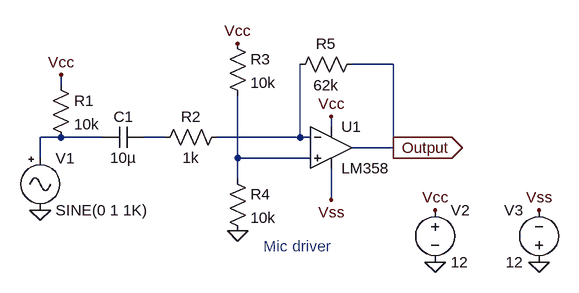
[diagram p0: schematic MicDriver.asc]
MicDriver.asc, the LTspice schematic file:
Version 4
SHEET 1 880 680
WIRE 416 48 352 48
WIRE -96 80 -96 64
WIRE 320 144 320 128
WIRE -96 160 -128 160
WIRE -32 160 -96 160
WIRE 64 160 32 160
WIRE 272 160 272 48
WIRE 272 160 144 160
WIRE 288 160 272 160
WIRE 416 176 416 48
WIRE 416 176 352 176
WIRE -128 192 -128 160
WIRE 176 192 176 96
WIRE 288 192 176 192
WIRE 176 224 176 192
WIRE 320 256 320 208
FLAG -128 272 0
FLAG -96 64 Vcc
FLAG 320 128 Vcc
FLAG 320 256 Vss
FLAG 176 304 0
FLAG 176 16 Vcc
FLAG 416 176 Output
IOPIN 416 176 Out
FLAG 480 352 0
FLAG 640 352 0
FLAG 480 272 Vcc
FLAG 640 272 Vss
SYMBOL Misc\\signal -128 176 R0
SYMATTR InstName V1
SYMBOL res -112 64 R0
SYMATTR InstName R1
SYMATTR Value 10k
SYMBOL Opamps\\opamp2 320 112 R0
SYMATTR InstName U1
SYMATTR Value LM358
SYMBOL cap 32 144 R90
WINDOW 0 0 32 VBottom 2
WINDOW 3 32 32 VTop 2
SYMATTR InstName C1
SYMATTR Value 10µ
SYMBOL res 160 144 R90
WINDOW 0 0 56 VBottom 2
WINDOW 3 32 56 VTop 2
SYMATTR InstName R2
SYMATTR Value 1k
SYMBOL res 160 0 R0
SYMATTR InstName R3
SYMATTR Value 10k
SYMBOL res 160 208 R0
SYMATTR InstName R4
SYMATTR Value 10k
SYMBOL res 368 32 R90
WINDOW 0 0 56 VBottom 2
WINDOW 3 32 56 VTop 2
SYMATTR InstName R5
SYMATTR Value 62k
SYMBOL voltage 480 256 R0
WINDOW 123 0 0 Left 2
WINDOW 39 0 0 Left 2
SYMATTR InstName V2
SYMATTR Value 12
SYMBOL voltage 640 368 R180
WINDOW 0 24 96 Left 2
WINDOW 3 24 16 Left 2
WINDOW 123 0 0 Left 2
WINDOW 39 0 0 Left 2
SYMATTR InstName V3
SYMATTR Value 12
TEXT 216 328 Left 2 ;Mic driver

The netlist it stands for:
* MicDriver.asc
V1 N001 0 SINE(0 1 1K)
R1 Vcc N001 10k
XU1 N004 N003 Vcc Vss Output LM358  ; pins In+ In- V+ V- OUT
C1 N002 N001 10µ
R2 N003 N002 1k
R3 Vcc N004 10k
R4 N004 0 10k
R5 Output N003 62k
V2 Vcc 0 12
V3 0 Vss 12
* Mic driver
.backanno
.end